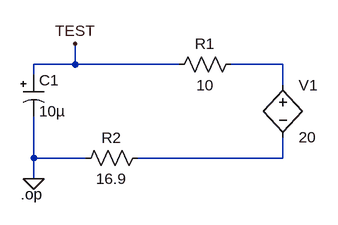
[diagram p0: schematic LT spice primer kola.asc]
LT spice primer kola.asc, the LTspice schematic file:
Version 4
SHEET 1 880 680
WIRE 80 64 80 32
WIRE 80 64 16 64
WIRE 240 64 80 64
WIRE 400 64 320 64
WIRE 16 80 16 64
WIRE 400 96 400 64
WIRE 16 208 16 144
WIRE 96 208 16 208
WIRE 400 208 400 176
WIRE 400 208 176 208
WIRE 16 240 16 208
FLAG 16 240 0
FLAG 80 32 TEST
SYMBOL res 336 48 R90
WINDOW 0 0 56 VBottom 2
WINDOW 3 32 56 VTop 2
SYMATTR InstName R1
SYMATTR Value 10
SYMATTR SpiceLine tol=1 pwr=0.1
SYMBOL res 192 192 R90
WINDOW 0 0 56 VBottom 2
WINDOW 3 32 56 VTop 2
SYMATTR InstName R2
SYMATTR Value 16.9
SYMATTR SpiceLine tol=1 pwr=0.1
SYMBOL polcap 0 80 R0
WINDOW 3 24 56 Left 2
SYMATTR InstName C1
SYMATTR Value 10µ
SYMATTR Description Capacitor
SYMATTR Type cap
SYMATTR SpiceLine V=6.3 Irms=0 Rser=4 Lser=0 mfg="AVX" pn="TAJA106M006" type="Tantalum"
SYMBOL bv 400 80 R0
SYMATTR InstName V1
SYMATTR Value 20
TEXT -4 264 Left 2 !.op

The netlist it stands for:
* LT spice primer kola.asc
R1 N001 TEST 10 tol=1 pwr=0.1
R2 N002 0 16.9 tol=1 pwr=0.1
C1 TEST 0 10µ V=6.3 Irms=0 Rser=4 Lser=0 mfg="AVX" pn="TAJA106M006" type="Tantalum"
B§V1 N001 N002 20
.op
.backanno
.end